# Altium schematic sheet Module_AFE_FPC.SchDoc
size A4
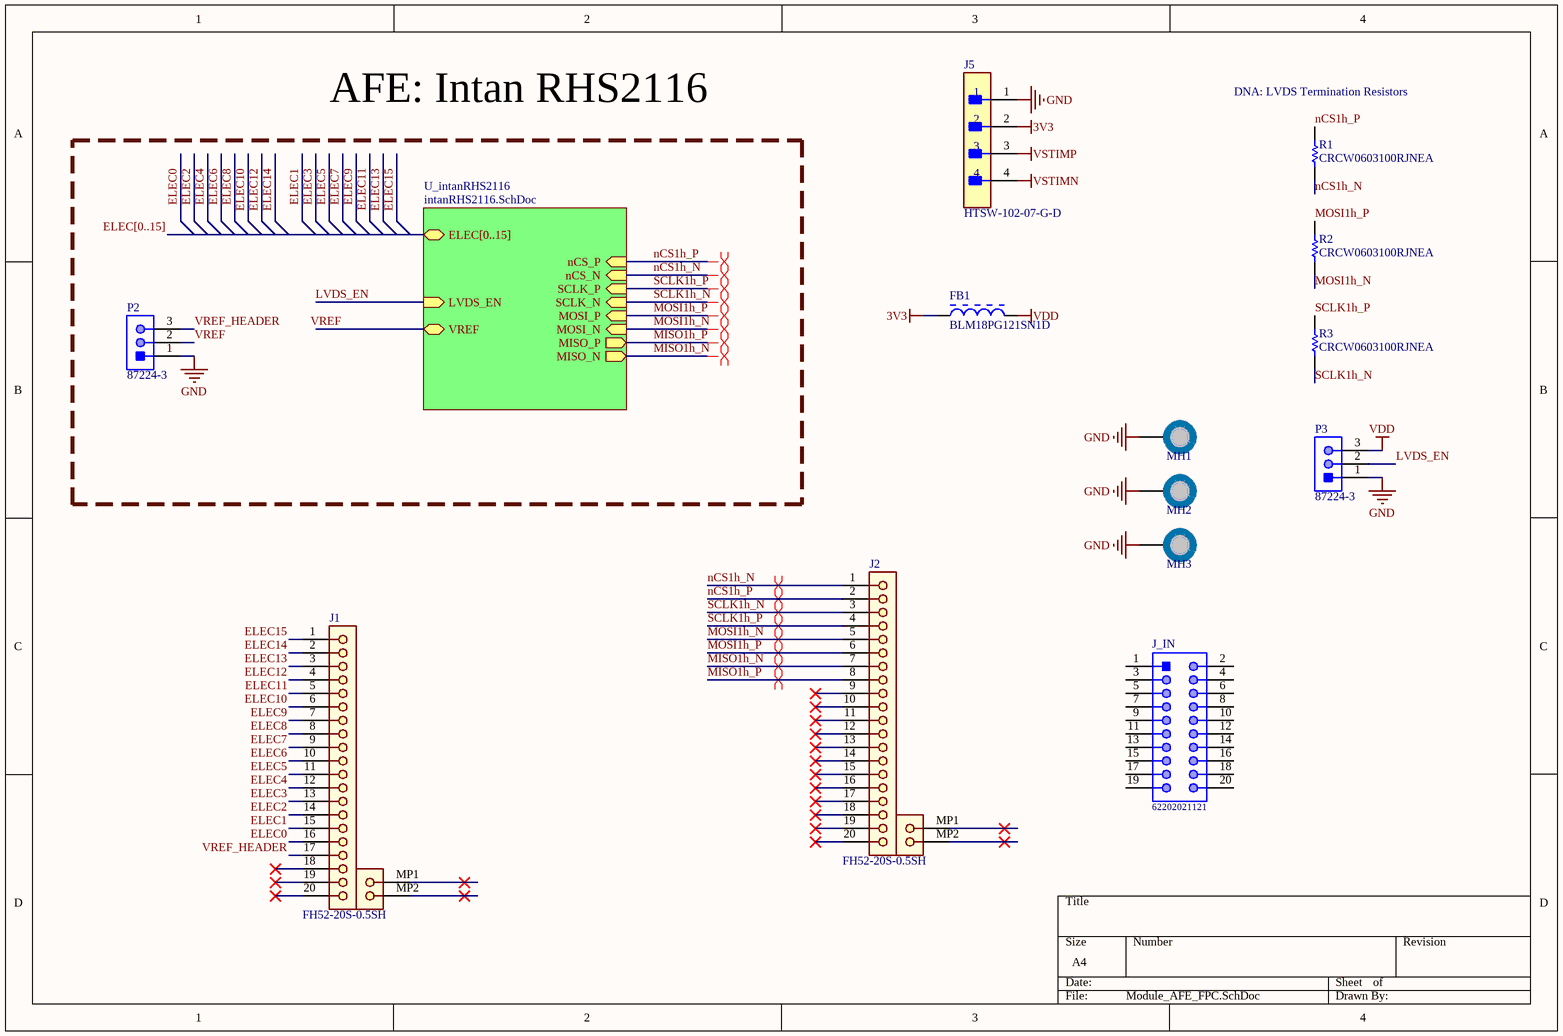
[diagram p0: Module_AFE_FPC.SchDoc]

## Parts
FB1  BLM18PG121SN1D  [MURA-BLM18PG_KG-B25-CHIP-2_V1]
J1  FH52-20S-0.5SH  [FH52-20S-0.5SH]
J2  FH52-20S-0.5SH  [FH52-20S-0.5SH]
J5  HTSW-102-07-G-D  [FP-HTSW-102-07-G-D-MFG]
J_IN  62202021121  [62202021121]
MH1  MH_7.4MMC_3.2MMD  [M2X0.4_plated_loose_fit_pan_head]  (value not drawn)  (no BOM)
MH2  MH_7.4MMC_3.2MMD  [M2X0.4_plated_loose_fit_pan_head]  (value not drawn)  (no BOM)
MH3  MH_7.4MMC_3.2MMD  [M2X0.4_plated_loose_fit_pan_head]  (value not drawn)  (no BOM)
P2  87224-3  [TECO-87224-3_V]
P3  87224-3  [TECO-87224-3_V]
R1  CRCW0603100RJNEA  [RESC1609X50X30ML10T20]
R2  CRCW0603100RJNEA  [RESC1609X50X30ML10T20]
R3  CRCW0603100RJNEA  [RESC1609X50X30ML10T20]

## Sub-sheets
U_intanRHS2116 = intanRHS2116.SchDoc: nCS_N (in), nCS_P (in), SCLK_N (in), SCLK_P (in), MOSI_N (in), MOSI_P (in), MISO_N (out), MISO_P (out), ELEC[0..15] (bidir), LVDS_EN (in), VREF (bidir)

## Nets
3V3: FB1.1 J5.2
GND: J5.1 MH1.1 MH2.1 MH3.1 P2.1 P3.1
VDD: FB1.2 P3.3
VSTIMN: J5.4
VSTIMP: J5.3
ELEC0: J1.16
ELEC1: J1.15
ELEC2: J1.14
ELEC3: J1.13
ELEC4: J1.12
ELEC5: J1.11
ELEC6: J1.10
ELEC7: J1.9
ELEC8: J1.8
ELEC9: J1.7
ELEC10: J1.6
ELEC11: J1.5
ELEC12: J1.4
ELEC13: J1.3
ELEC14: J1.2
ELEC15: J1.1
LVDS_EN: P3.2 ; sheet U_intanRHS2116/LVDS_EN
MISO1h_N: J2.7 ; sheet U_intanRHS2116/MISO_N
MISO1h_P: J2.8 ; sheet U_intanRHS2116/MISO_P
MOSI1h_N: J2.5 R2.1 ; sheet U_intanRHS2116/MOSI_N
MOSI1h_P: J2.6 R2.2 ; sheet U_intanRHS2116/MOSI_P
nCS1h_N: J2.1 R1.1 ; sheet U_intanRHS2116/nCS_N
nCS1h_P: J2.2 R1.2 ; sheet U_intanRHS2116/nCS_P
SCLK1h_N: J2.3 R3.1 ; sheet U_intanRHS2116/SCLK_N
SCLK1h_P: J2.4 R3.2 ; sheet U_intanRHS2116/SCLK_P
VREF: P2.2 ; sheet U_intanRHS2116/VREF
VREF_HEADER: J1.17 P2.3

Not connected (* = marked no-connect by the designer): J1 18* 19* 20* MP1* MP2*; J2 9* 10* 11* 12* 13* 14* 15* 16* 17* 18* 19* 20* MP1* MP2*; J_IN 1 2 3 4 5 6 7 8 9 10 11 12 13 14 15 16 17 18 19 20

## Buses and harness runs
bus ELEC[0..15] = sheet U_intanRHS2116/ELEC[0..15]

## Layout directives
differential pair: MISO1h_N, MISO1h_P, MOSI1h_N, MOSI1h_P, nCS1h_N, nCS1h_P, SCLK1h_N, SCLK1h_P

## Notes on the sheet
- AFE: Intan RHS2116
- (near R1) DNA: LVDS Termination Resistors

## Library data of the parts
FB1 = CMP-0686-00557-6: Chip Ferrite Bead for Power Lines, 120 Ohm, 2000 mA, -55 to 125 degC, 1.6 x 0.8 x 0.95 mm SMD, Tape and Reel; Manufacturer: Murata; Impedance (at 100 MHz): 120 Ohm +/- 25%; Rated Current: 2000 mA; DC Resistance: 0.05 Ohm Max.; DatasheetVersion: 08/2013; PackageDescription: 2-Pin Chip, Body 1.6 x 0.8 mm; ComponentLink3URL: http://www.murata.com/products/catalog/pdf/c31e.pdf; PartNumber: BLM18PG121SN1D; ComponentLink1URL: http://www.murata.com/; ComponentLink2Description: Datasheet; Mounting Technology: Surface Mount; ComponentLink1Description: Manufacturer URL; PackageReference: BLM18_H950-2; ComponentLink2URL: http://www.murata.com/products/catalog/pdf/c31e.pdf; ComponentLink3Description: Package Specification; Packing: Tape and Reel; Operating Temperature Range: -55 to 125 degC
J1 J2 = FH52-20S-0.5SH: 01X20 Terminal Connector with  2 mount ground pads; Manufacturer: Hirose; Manufacturer PN: FH52-20S-0.5SH
J5 = CMP-02766-000010-1: CONN HEADER VERT 4POS 2.54MM; Manufacturer: Samtec; Voltage Rating: 550V; Conn Orientation: Straight; Number Of Contacts: 4; Conn Gender: Male; Current Rating: 6.3A; Number Of Rows: 2; Category: Conn; Temperature: -55°C to +125°C; Automotive: No; Digikey Description: CONN HEADER VERT 4POS 2.54MM; ComponentLink2URL: http://suddendocs.samtec.com/catalog_english/htsw_th.pdf; Device Class L2: Headers and Wire Housings; Mouser Description: Conn Unshrouded Header HDR 4 POS 2.54mm Solder ST Thru-Hole Bag; Manufacturer Part Number: HTSW-102-07-G-D; Temperature Range High: +125°C; Contact Material: Gold,Nickel; Temperature Range Low: -55°C; ComponentLink2Description: Datasheet; Device Class L1: Connectors; Pitch: 2.54mm; Octopart: https://octopart.com/htsw-102-07-g-d-samtec-10531767; RoHS: TRUE; Package: HTSW-102-07-G-D; Lead Free: Yes; Device Class L3: unset; Height: 8.71mm
J_IN = CMP-1502-00951-1: THT Vertical Pin Header WR-PHD, Pitch 1.27 mm, Dual Row, 20 pins; Manufacturer: Wurth Elektronik; Pin Number: 20; Gender: Male; Pitch: 1.27mm; Contact Resistance: 20mOhm; Rated Current: 1A; Withstanding Voltage: 500VAC; Working Voltage: 100VAC; Manufacturer URL: http://www.we-online.de; Mounting Technology: THT; Operating Temperature: -40to105degC; Datasheet URL: https://katalog.we-online.de/em/datasheet/62202021121.pdf; Package Reference: 62202021121; Part Number: 62202021121; Row Number: Dual; Publisher: WurthElektronik; Packaging: Box; Orientation: Vertical
MH1-MH3 = MH_7.4MMC_3.2MMC: Mounting Hole 7.4mm Diameter, 3.2mm Drill
P2 P3 = CMP-2000-05697-1: Male Header, Pitch 2.54 mm, 1 x 3 Position, Height 10.744 mm, Tail Length 3.175 mm, -65 to 105 degC, RoHS, Bulk; Manufacturer: TE Connectivity; Catalog Drawings: SingleSquareStraightPost / SingleSquareStraightPostSide; Connector Type: Header,Unshrouded; Pitch: 0.100"(2.54mm); Mating Products: 147738-2-ND / -CONNRCPT3POSVERTSMDGOLD / 147723-2-ND / -CONNRCPT3POSVERT.100GOLD / 146763-5-ND / -CONNRCPT3POSSGLVERT.100T/H / A32904-ND / -CONNRECEPT3POS.100VERTGOLD / A26922-ND / -CONNHOUSING3POS.100LOCKING / A26415-ND / -CONNRECEPT3POS.100VERTAU / A26964-ND / -CONNHOUSING3POS.100SINGLE / A3012-ND / -CONNHOUSING3POS.100SINGLE; Number of Positions Loaded: All; Featured Product: AMPMODUConnectors; Dynamic Catalog: AMPMODUModIISeries; 3D Model: 87224-3.pdf; Other Names: 87224-3-ND / A26545; Number of Positions: 3; RoHS Information: 87224-3StatementofCompliance; Termination: Solder; Datasheet URL: http://www.te.com/commerce/DocumentDelivery/DDEController?Action=showdoc&DocId=Customer+Drawing%7F87224%7FL3%7Fpdf%7FEnglish%7FENG_CD_87224_L3.pdf%7F87224-3; Category: Connectors,Interconnects; Contact Mating Length: 0.318"(8.08mm); Standard Package: 520; Mounting Type: ThroughHole; Family: RectangularConnectors-Headers,MalePins; Number of Rows: 1; Series: AMPMODUModII; Contact Finish Thickness: 15µin(0.38µm); Datasheet Version: Rev. L3, 08/2015; Package Reference: 87224-3; Mounting Technology: ThroughHole; Manufacturer URL: http://www.te.com/; Contact Type: MalePin; Packaging: Bulk; Color: Black; Package Description: Male Header, Pitch 2.54 mm, 1 x 3 Position, Height 10.744 mm, Tail Length 3.175 mm; Contact Finish: Gold
R1-R3 = CMP-2000-03827-1: Manufacturer: Vishay Dale; Part Number: CRCW0603100RJNEA